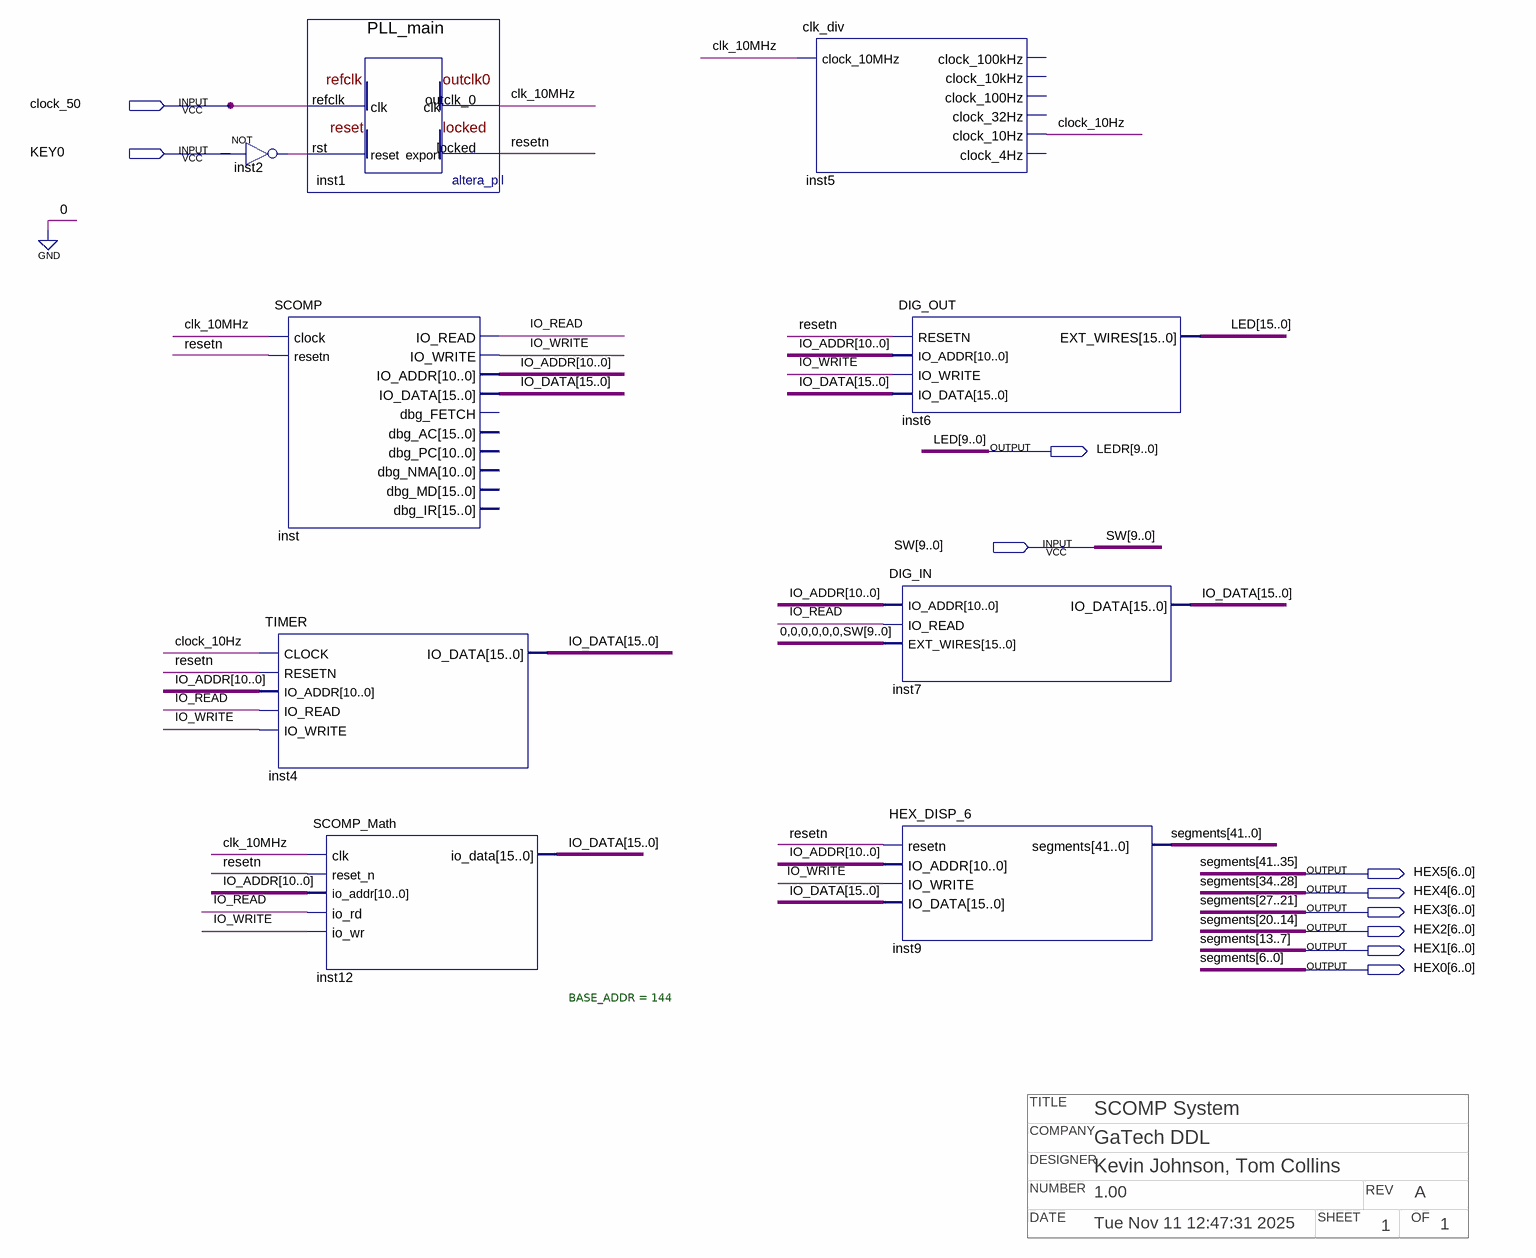
[diagram p0: schematic sheet]
// Quartus schematic SCOMP_System.bdf as structural Verilog: 9 symbols, 10 pins
// Title block: TITLE: SCOMP System; COMPANY: GaTech DDL; DESIGNER: Kevin Johnson, Tom Collins; NUMBER: 1.00; REV: A; DATE: Tue Nov 11 12:47:31 2025; SHEET: 1; OF: 1
module SCOMP_System (
  input  clock_50,
  input  KEY0,
  input  [9:0] SW,
  output [9:0] LEDR,
  output [6:0] HEX5,
  output [6:0] HEX4,
  output [6:0] HEX3,
  output [6:0] HEX2,
  output [6:0] HEX1,
  output [6:0] HEX0
);

  wire clk_10MHz, clock_10Hz, inst2_out, IO_READ, IO_WRITE, resetn;
  wire [10:0] IO_ADDR;
  wire [15:0] IO_DATA;
  wire [15:10] LED;

  not inst2 (inst2_out, KEY0);
  SCOMP inst (
    .clock(clk_10MHz), .resetn(resetn), .IO_READ(IO_READ), .IO_WRITE(IO_WRITE), .IO_ADDR(IO_ADDR),
    .IO_DATA(IO_DATA));  // open: dbg_FETCH, dbg_AC, dbg_PC, dbg_NMA, dbg_MD, dbg_IR
  TIMER inst4 (
    .CLOCK(clock_10Hz), .RESETN(resetn), .IO_ADDR(IO_ADDR), .IO_READ(IO_READ), .IO_WRITE(IO_WRITE),
    .IO_DATA(IO_DATA));
  PLL_main inst1 (.refclk(clock_50), .rst(inst2_out), .outclk_0(clk_10MHz), .locked(resetn));
  SCOMP_Math #(.BASE_ADDR(144)) inst12 (
    .clk(clk_10MHz), .reset_n(resetn), .io_addr(IO_ADDR), .io_rd(IO_READ), .io_wr(IO_WRITE), .io_data(IO_DATA));
  clk_div inst5 (
    .clock_10MHz(clk_10MHz), .clock_10Hz(clock_10Hz));  // open: clock_100kHz, clock_10kHz, clock_100Hz, clock_32Hz, clock_4Hz
  DIG_IN inst7 (.IO_ADDR(IO_ADDR), .IO_READ(IO_READ), .EXT_WIRES({{6{1'b0}}, SW}), .IO_DATA(IO_DATA));
  HEX_DISP_6 inst9 (
    .resetn(resetn), .IO_ADDR(IO_ADDR), .IO_WRITE(IO_WRITE), .IO_DATA(IO_DATA),
    .segments({HEX5, HEX4, HEX3, HEX2, HEX1, HEX0}));
  DIG_OUT inst6 (.RESETN(resetn), .IO_ADDR(IO_ADDR), .IO_WRITE(IO_WRITE), .IO_DATA(IO_DATA), .EXT_WIRES({LED, LEDR}));

  // Other names for the same wires on the sheet: LED[9:0] = LEDR;
  //   segments[41:0] = {HEX5, HEX4, HEX3, HEX2, HEX1, HEX0}
endmodule
